# Altium schematic sheet Sheet7.SchDoc
size A
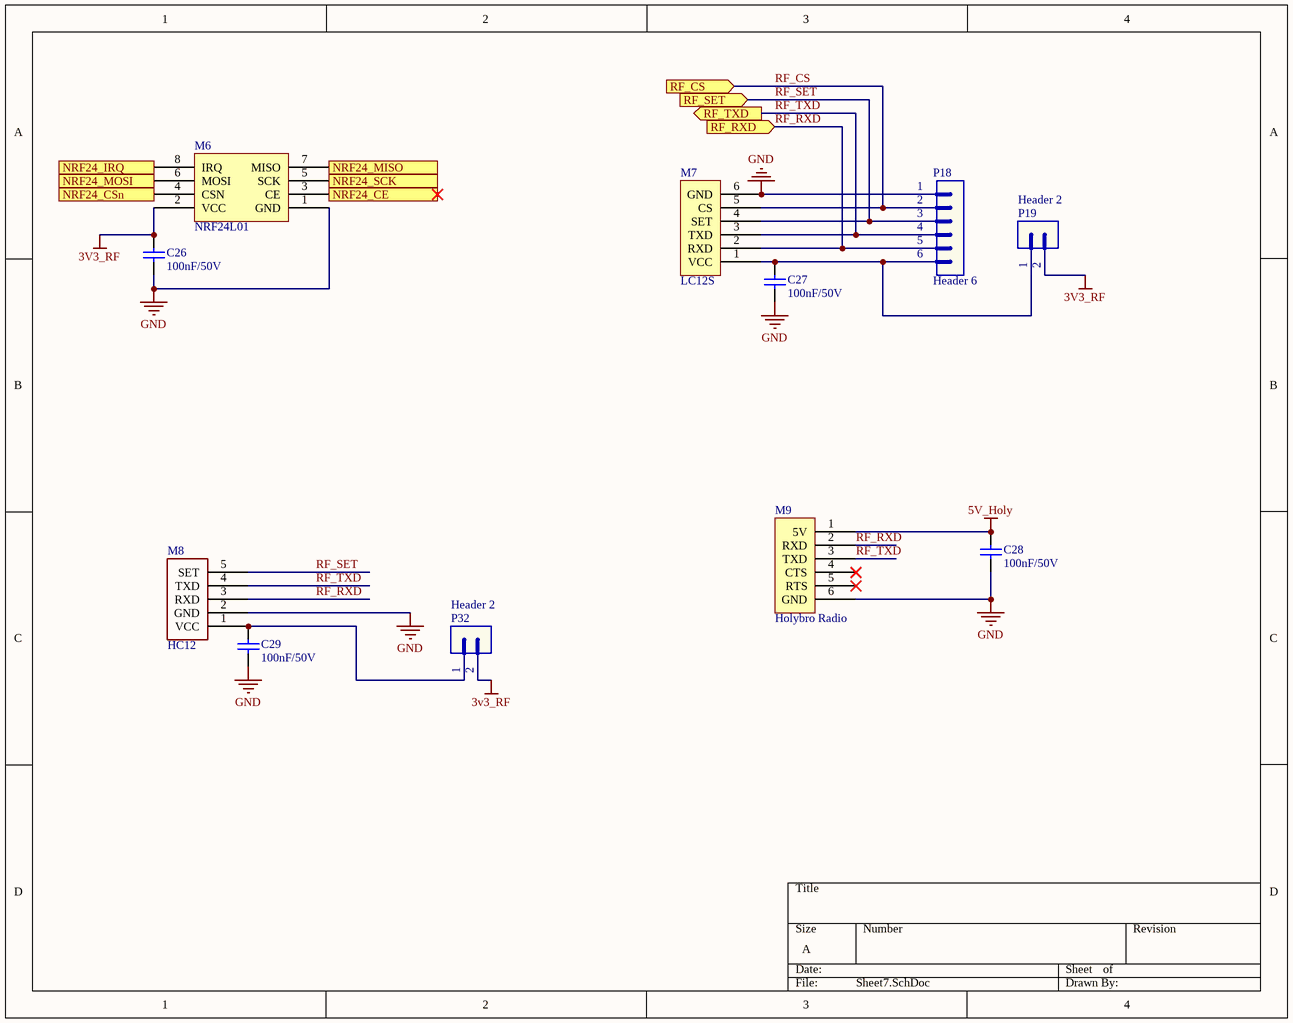
[diagram p0: Sheet7.SchDoc]

## Parts
C26  value 100nF/50V  [CAP-SM-0805]  (hidden comment: Cap-1nF-50V-0805)
C27  value 100nF/50V  [CAP-SM-0805]  (hidden comment: Cap-1nF-50V-0805)
C28  value 100nF/50V  [CAP-SM-0805]  (hidden comment: Cap-1nF-50V-0805)
C29  value 100nF/50V  [CAP-SM-0805]  (hidden comment: Cap-1nF-50V-0805)
M6  NRF24L01  [NRF24L01]
M7  LC12S  [LC12S]
M8  HC12  [HC12]
M9  Holybro Radio  [Holybro]
P18  Header 6  [JP6]
P19  Header 2  [JP2]
P32  Header 2  [JP2]

## Ports
NRF24_CE (in), NRF24_CSn (in), NRF24_IRQ (out), NRF24_MISO (out), NRF24_MOSI (in), NRF24_SCK (in), RF_CS (in), RF_RXD (in), RF_SET (in), RF_TXD (out)

## Nets
3V3_RF: C26.2 M6.2(VCC) P19.2 P32.2
5V_Holy: C28.2 M9.1(5V)
GND: C26.1 C27.1 C28.1 C29.1 M6.1(GND) M7.6(GND) M8.2(GND) M9.6(GND) P18.1
NRF24_CE: M6.3(CE) ; port NRF24_CE
NRF24_CSn: M6.4(CSN) ; port NRF24_CSn
NRF24_IRQ: M6.8(IRQ) ; port NRF24_IRQ
NRF24_MISO: M6.7(MISO) ; port NRF24_MISO
NRF24_MOSI: M6.6(MOSI) ; port NRF24_MOSI
NRF24_SCK: M6.5(SCK) ; port NRF24_SCK
RF_CS: M7.5(CS) P18.2 ; port RF_CS
RF_RXD: M7.2(RXD) M8.3(RXD) M9.2(RXD) P18.5 ; port RF_RXD
RF_SET: M7.4(SET) M8.5(SET) P18.3 ; port RF_SET
RF_TXD: M7.3(TXD) M8.4(TXD) M9.3(TXD) P18.4 ; port RF_TXD
NetC27_2: C27.2 M7.1(VCC) P18.6 P19.1
NetC29_2: C29.2 M8.1(VCC) P32.1

Not connected (* = marked no-connect by the designer): M9 4(CTS)* 5(RTS)*

## Library data of the parts
C26-C29 = Cap-1nF-50V-0805: CAP CER 1000PF 100V X7R 0805; Manufacturer: Johanson Dielectrics Inc.; Manufacturer Part Number: 101X15W102MV4E; Local Supplier: thegioiic; Local Supplier Link: https://thegioiic.com/products/tu-1nf-50v-0805; Supplier 1: Digikey; Supplier 1 Link: https://www.digikey.com/product-detail/en/johanson-dielectrics-inc/101X15W102MV4E/709-1335-1-ND/2327235; Supplier 1 Part Number: 709-1335-1-ND
M6 = NRF24L01: Local supply: Hshop; Local supply link: https://lastminuteengineers.com/nrf24l01-arduino-wireless-communication/
M7 = LC12S: Local supply: HShop; Local supply link: https://hshop.vn/products/mach-thu-phat-rf-uart-lc12s-2-4ghz
M8 = HC12: Local supply: Hshop; Local supply number: HS000897; Local supply link: https://hshop.vn/products/mach-thu-phat-rf-uart-si4463-433mhzkhoang-coch-1km
M9 = Holybro: Supplier: https://www.lazada.vn/products/ld-holybro-433mhz-915-mhz-500-mw-thu-phat-vo-tuyen-xa-bo-v3-cho-pixhawk-4-dieu-khien-chuyen-bay-i430804435-s768474304.html?spm=a2o4n.searchlist.list.4.25396b19yIS9XO&search=1
P18 = Header 6: Header, 6-Pin; LatestRevisionDate: 17-Jul-2002; LatestRevisionNote: Re-released for DXP Platform.; Publisher: Altium Limited
P19 P32 = Header 2: Header, 2-Pin; LatestRevisionDate: 17-Jul-2002; LatestRevisionNote: Re-released for DXP Platform.; Publisher: Altium Limited